# EAGLE design snappergps_board_2_1_0 (EAGLE 9.6.2)
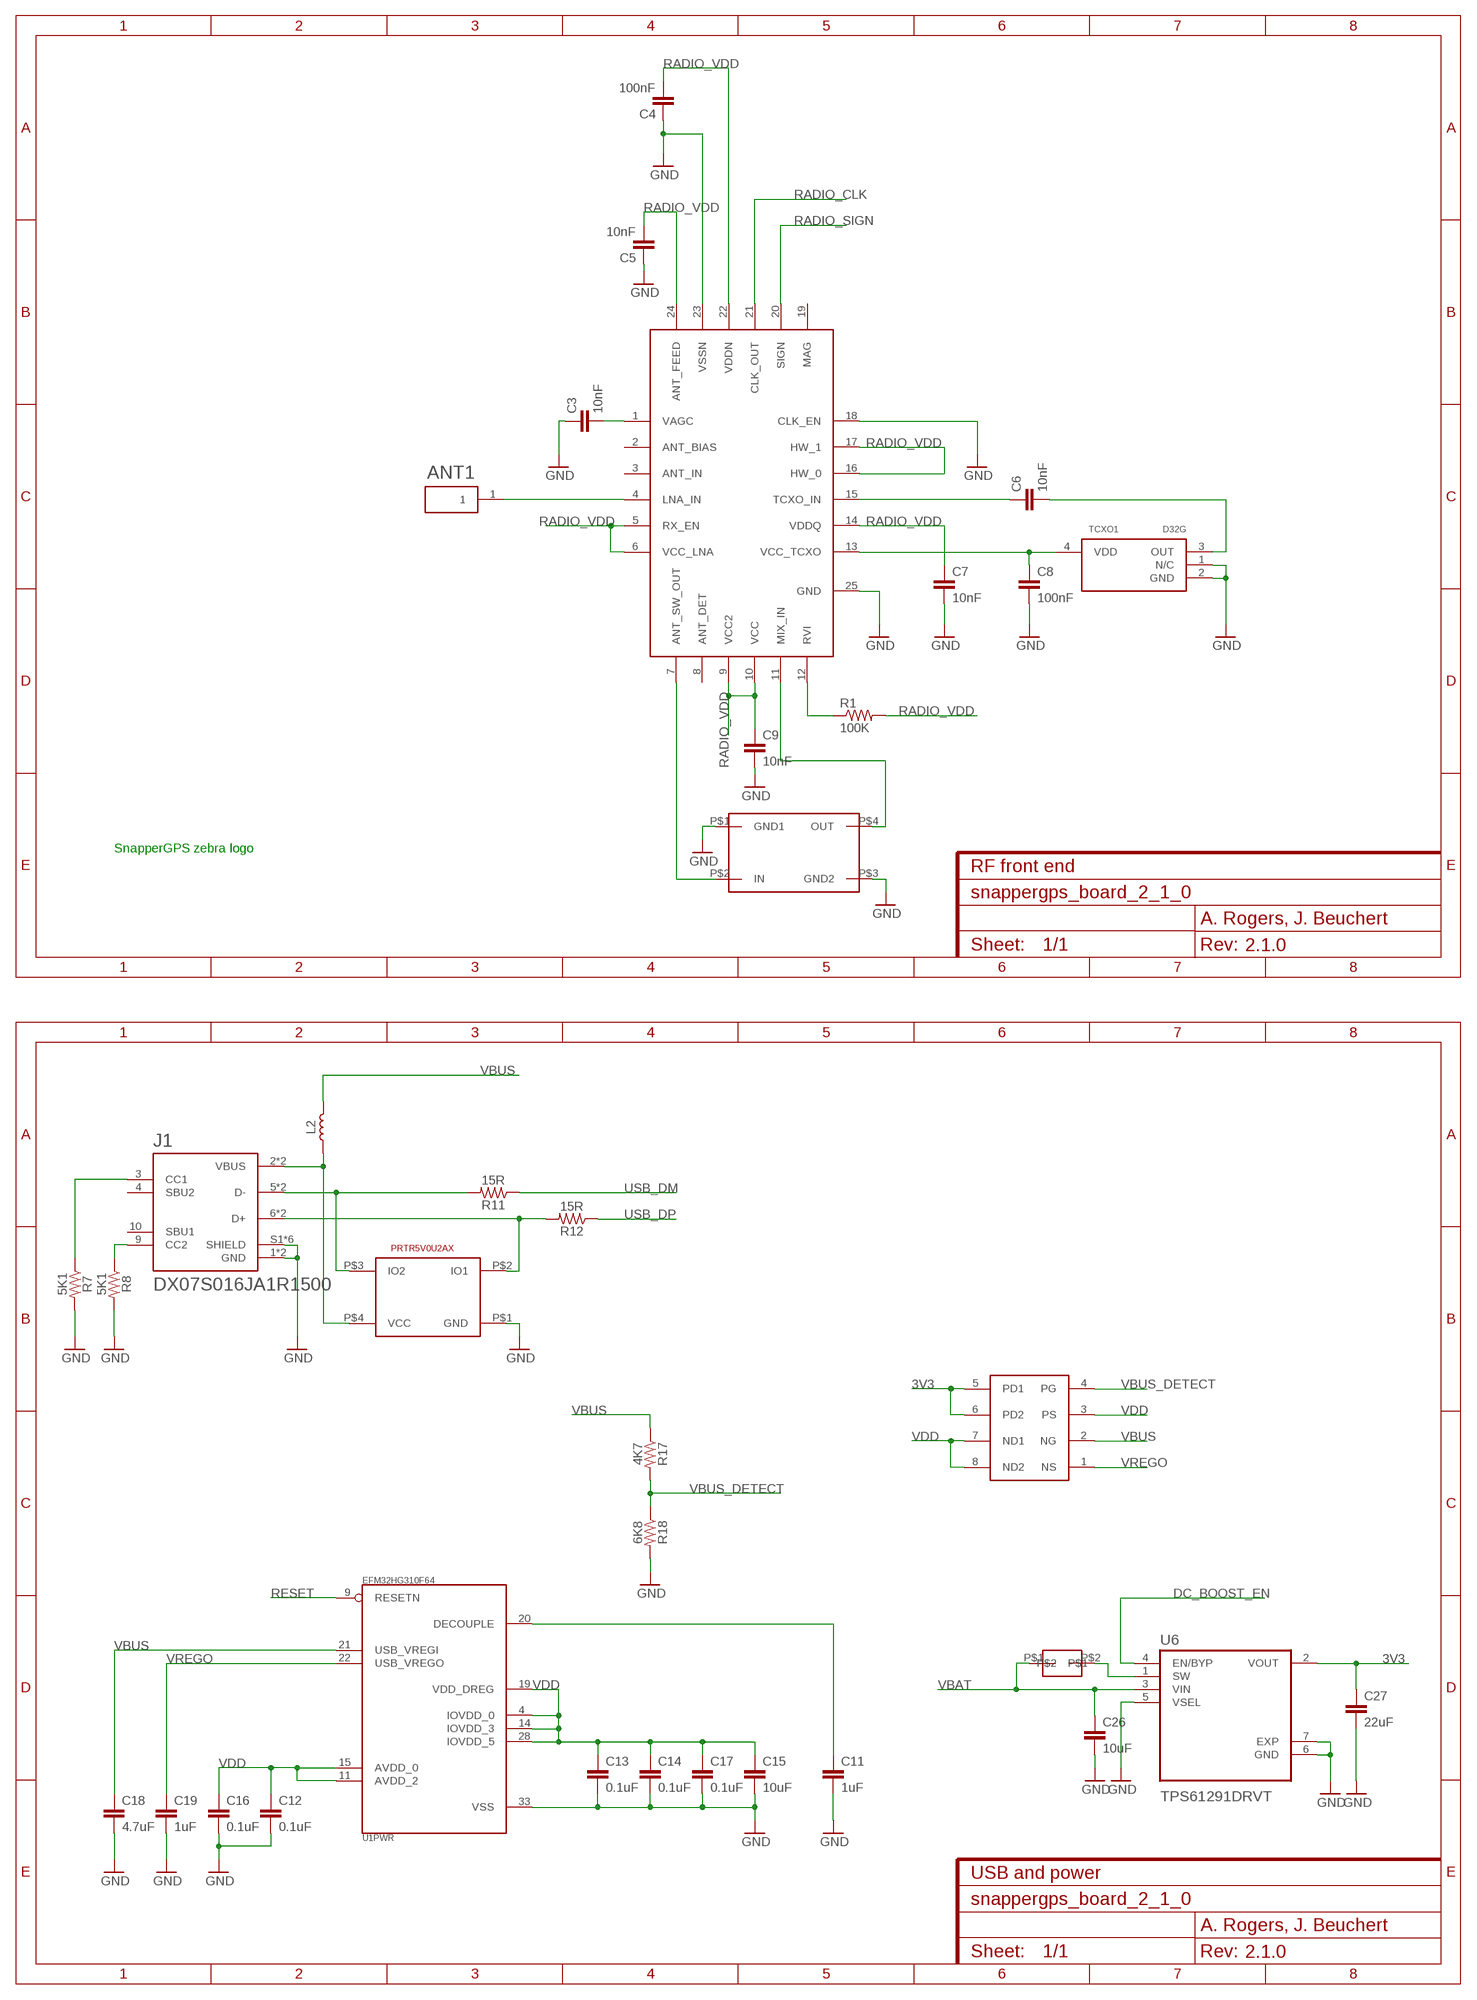
[diagram p0: schematic, sheet 1, part 1 of 2]
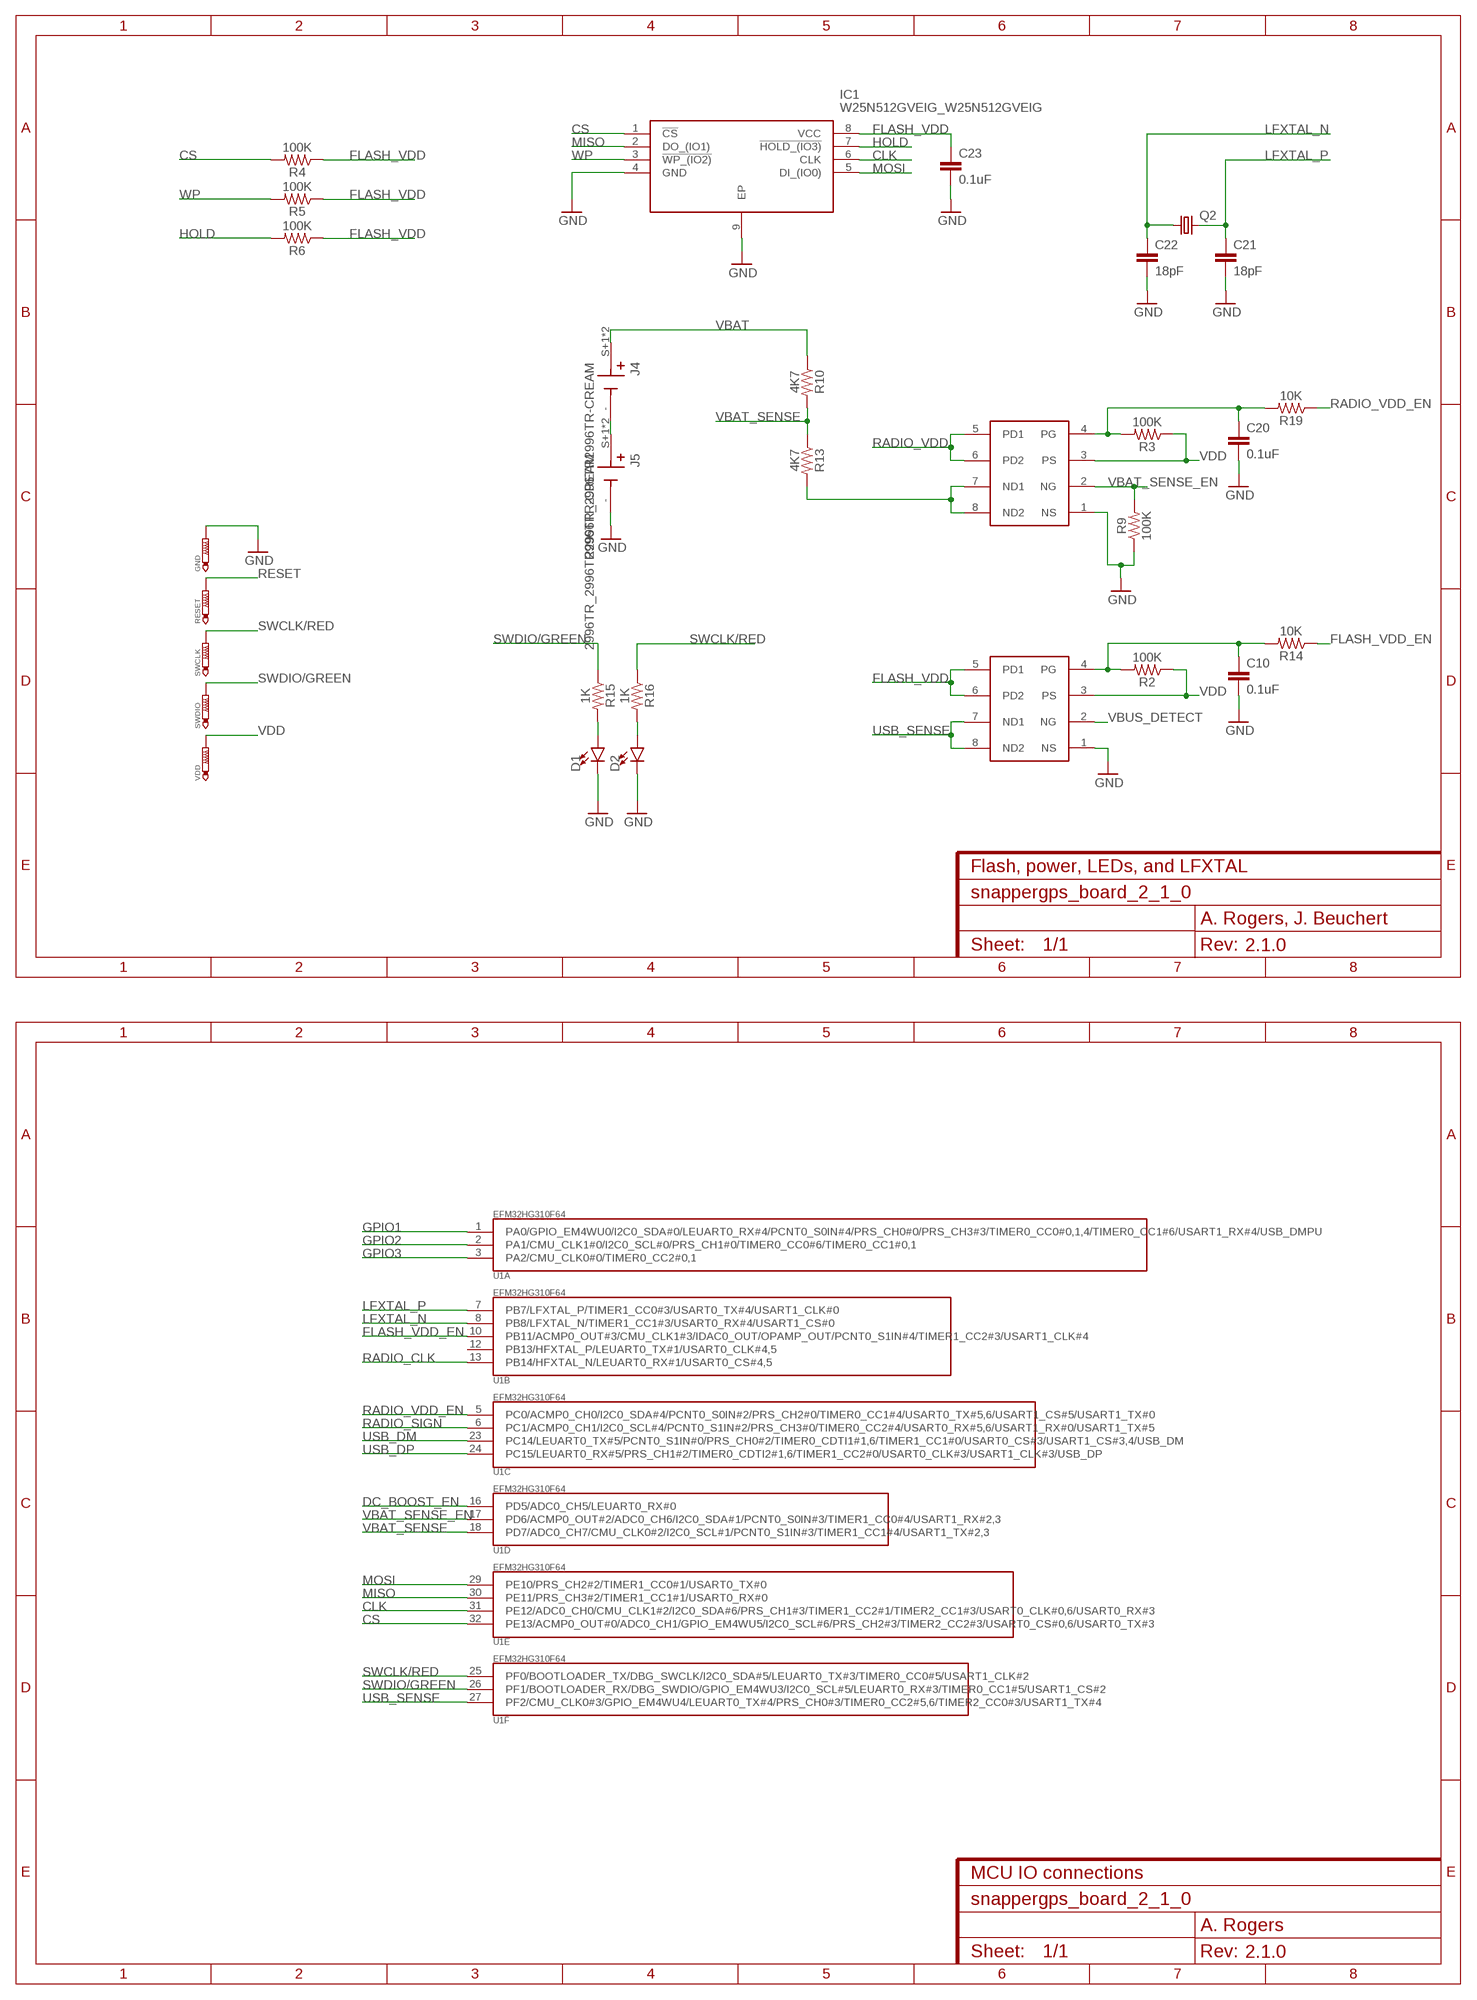
[diagram p1: schematic, sheet 1, part 2 of 2]
FRAME1 (FRAME-A4L): CNAME: RF front end; CREVISION: 2.1.0; DESIGNER: A. Rogers, J. Beuchert; REV: 2.4
FRAME2 (FRAME-A4L): CNAME: Flash, power, LEDs, and LFXTAL; CREVISION: 2.1.0; DESIGNER: A. Rogers, J. Beuchert
FRAME3 (FRAME-A4L): CNAME: USB and power; CREVISION: 2.1.0; DESIGNER: A. Rogers, J. Beuchert
FRAME4 (FRAME-A4L): CNAME: MCU IO connections; CREVISION: 2.1.0; DESIGNER: A. Rogers

## Parts
ANT1  GP.1575.25.2.A.02  [GP1575252A02]
C3  10nF  CAPACITOR_0402  [0402]
C4  100nF  CAPACITOR_0402  [0402]
C5  10nF  CAPACITOR_0402  [0402]
C6  10nF  CAPACITOR_0402  [0402]
C7  10nF  CAPACITOR_0402  [0402]
C8  100nF  CAPACITOR_0402  [0402]
C9  10nF  CAPACITOR_0402  [0402]
C10  0.1uF  CAPACITOR_0402  [0402]
C11  1uF  CAPACITOR_0603  [0603]
C12  0.1uF  CAPACITOR_0402  [0402]
C13  0.1uF  CAPACITOR_0402  [0402]
C14  0.1uF  CAPACITOR_0402  [0402]
C15  10uF  CAPACITOR_0603  [0603]
C16  0.1uF  CAPACITOR_0402  [0402]
C17  0.1uF  CAPACITOR_0402  [0402]
C18  4.7uF  CAPACITOR_0603  [0603]
C19  1uF  CAPACITOR_0603  [0603]
C20  0.1uF  CAPACITOR_0402  [0402]
C21  18pF  CAPACITOR_0402  [0402]
C22  18pF  CAPACITOR_0402  [0402]
C23  0.1uF  CAPACITOR_0402  [0402]
C26  10uF  C-EUC0603K  [C0603K]
C27  22uF  C-EUC0603K  [C0603K]
D1  LED0603  [LED-0603]
D2  LED0603  [LED-0603]
GND  PTR1B1,27  [B1,27]
IC1  W25N512GVEIG_W25N512GVEIG  [W25N512GVEIG_SON127P800X600X80-9N]
J1  DX07S016JA1R1500  [JAE_DX07S016JA1R1500]
J4  2996TR_2996TR2996TR-CREAM  [2996TR_BAT_2996TR]
J5  2996TR_2996TR2996TR-CREAM  [2996TR_BAT_2996TR]
L2  INDUCTOR  [0402]
Q1  TT8M1TRAMANDA  [AMANDA_TSST8]
Q2  CRYSTAL_JTX310  [3.2X1.5]
Q3  TT8M1TRAMANDA  [AMANDA_TSST8]
Q4  TT8M1TRAMANDA  [AMANDA_TSST8]
R1  100K  RESISTOR_0402  [0402]
R2  100K  RESISTOR_0402  [0402]
R3  100K  RESISTOR_0402  [0402]
R4  100K  RESISTOR_0402  [0402]
R5  100K  RESISTOR_0402  [0402]
R6  100K  RESISTOR_0402  [0402]
R7  5K1  RESISTOR_0402  [0402]
R8  5K1  RESISTOR_0402  [0402]
R9  100K  RESISTOR_0402  [0402]
R10  4K7  RESISTOR_0402  [0402]
R11  15R  RESISTOR_0402  [0402]
R12  15R  RESISTOR_0402  [0402]
R13  4K7  RESISTOR_0402  [0402]
R14  10K  RESISTOR_0402  [0402]
R15  1K  RESISTOR_0402  [0402]
R16  1K  RESISTOR_0402  [0402]
R17  4K7  RESISTOR_0402  [0402]
R18  6K8  RESISTOR_0402  [0402]
R19  10K  RESISTOR_0402  [0402]
RESET  PTR1B1,27  [B1,27]
SAW1  SAW_FILTER  [SAW_FILTER]
SWCLK  PTR1B1,27  [B1,27]
SWDIO  PTR1B1,27  [B1,27]
TCXO1  D32G  [D32G]
U1  EFM32HG310F64  [QFN32]
U2  RF_CIRCUIT-SE4150L  [QFN50P400X400X90-25N]
U3  TVS_DIODE-PRTR5V0U2AX  [TVS_DIODE-PRTR5V0U2AX]
U6  TPS61291DRVT  [SON65P200X200X80-7N]
U7  MDMK2020T3R3MM  [MDMK2020T3R3MM]
VDD  PTR1B1,27  [B1,27]

## Nets
3V3: C27.1 Q4.5(PD1) Q4.6(PD2) U6.2(VOUT)
CLK: IC1.6(CLK) U1.31(E:PE12/ADC0_CH0/CMU_CLK1#2/I2C0_SDA#6/PRS_CH1#3/TIMER1_CC2#1/TIMER2_CC1#3/USART0_CLK#0,6/USART0_RX#3)
CS: IC1.1(!CS) R4.2 U1.32(E:PE13/ACMP0_OUT#0/ADC0_CH1/GPIO_EM4WU5/I2C0_SCL#6/PRS_CH2#3/TIMER2_CC2#3/USART0_CS#0,6/USART0_TX#3)
DC_BOOST_EN: U1.16(D:PD5/ADC0_CH5/LEUART0_RX#0) U6.4(EN/BYP)
FLASH_VDD: C23.1 IC1.8(VCC) Q3.5(PD1) Q3.6(PD2) R4.1 R5.1 R6.1
FLASH_VDD_EN: R14.1 U1.10(B:PB11/ACMP0_OUT#3/CMU_CLK1#3/IDAC0_OUT/OPAMP_OUT/PCNT0_S1IN#4/TIMER1_CC2#3/USART1_CLK#4)
GND: C3.1 C4.1 C5.1 C7.2 C8.2 C9.2 C10.2 C11.2 C12.2 C13.2 C14.2 C15.2 C16.2 C17.2 C18.2 C19.2 C20.2 C21.2 C22.2 C23.2 C26.2 C27.2 D1.C D2.C GND.TP IC1.4(GND) IC1.9(EP) J1.1(GND) J1.12(GND) J1.S1(SHIELD) J1.S2(SHIELD) J1.S3(SHIELD) J1.S4(SHIELD) J1.S5(SHIELD) J1.S6(SHIELD) J5.- Q1.1(NS) Q3.1(NS) R7.2 R8.2 R9.1 R18.2 SAW1.P$1(GND1) SAW1.P$3(GND2) TCXO1.1(N/C) TCXO1.2(GND) U1.33(PWR:VSS) U2.18(CLK_EN) U2.23(VSSN) U2.25(GND) U3.P$1(GND) U6.5(VSEL) U6.6(GND) U6.7(EXP)
GPIO1: U1.1(A:PA0/GPIO_EM4WU0/I2C0_SDA#0/LEUART0_RX#4/PCNT0_S0IN#4/PRS_CH0#0/PRS_CH3#3/TIMER0_CC0#0,1,4/TIMER0_CC1#6/USART1_RX#4/USB_DMPU)
GPIO2: U1.2(A:PA1/CMU_CLK1#0/I2C0_SCL#0/PRS_CH1#0/TIMER0_CC0#6/TIMER0_CC1#0,1)
GPIO3: U1.3(A:PA2/CMU_CLK0#0/TIMER0_CC2#0,1)
HOLD: IC1.7(!HOLD_(IO3)) R6.2
LFXTAL_N: C22.1 Q2.1 U1.8(B:PB8/LFXTAL_N/TIMER1_CC1#3/USART0_RX#4/USART1_CS#0)
LFXTAL_P: C21.1 Q2.2 U1.7(B:PB7/LFXTAL_P/TIMER1_CC0#3/USART0_TX#4/USART1_CLK#0)
MISO: IC1.2(DO_(IO1)) U1.30(E:PE11/PRS_CH3#2/TIMER1_CC1#1/USART0_RX#0)
MIXIN [rf]: SAW1.P$4(OUT) U2.11(MIX_IN)
MOSI: IC1.5(DI_(IO0)) U1.29(E:PE10/PRS_CH2#2/TIMER1_CC0#1/USART0_TX#0)
N$1: Q1.7(ND1) Q1.8(ND2) R13.2
N$2: C20.1 Q1.4(PG) R3.2 R19.2
N$3: J1.9(CC2) R8.1
N$4: J1.3(CC1) R7.1
N$5 [rf]: ANT1.1 U2.4(LNA_IN)
N$6: R1.1 U2.12(RVI)
N$7: U6.1(SW) U7.P$2
N$8 [rf]: SAW1.P$2(IN) U2.7(ANT_SW_OUT)
N$9: C8.1 TCXO1.4(VDD) U2.13(VCC_TCXO)
N$10: C6.1 U2.15(TCXO_IN)
N$11: C6.2 TCXO1.3(OUT)
N$13: C11.1 U1.20(PWR:DECOUPLE)
N$14: C10.1 Q3.4(PG) R2.2 R14.2
N$15: J4.- J5.S+1(+) J5.S+2(+)
N$16: D1.A R15.2
N$17: D2.A R16.2
N$19: C3.2 U2.1(VAGC)
N$26: J1.2(VBUS) J1.11(VBUS) L2.1 U3.P$4(VCC)
N$35: J1.6(D+) J1.7(D+) R12.2 U3.P$2(IO1)
N$36: J1.5(D-) J1.8(D-) R11.2 U3.P$3(IO2)
RADIO_CLK: U1.13(B:PB14/HFXTAL_N/LEUART0_RX#1/USART0_CS#4,5) U2.21(CLK_OUT)
RADIO_SIGN: U1.6(C:PC1/ACMP0_CH1/I2C0_SCL#4/PCNT0_S1IN#2/PRS_CH3#0/TIMER0_CC2#4/USART0_RX#5,6/USART1_RX#0/USART1_TX#5) U2.20(SIGN)
RADIO_VDD: C4.2 C5.2 C7.1 C9.1 Q1.5(PD1) Q1.6(PD2) R1.2 U2.5(RX_EN) U2.6(VCC_LNA) U2.9(VCC2) U2.10(VCC) U2.14(VDDQ) U2.16(HW_0) U2.17(HW_1) U2.22(VDDN) U2.24(ANT_FEED)
RADIO_VDD_EN: R19.1 U1.5(C:PC0/ACMP0_CH0/I2C0_SDA#4/PCNT0_S0IN#2/PRS_CH2#0/TIMER0_CC1#4/USART0_TX#5,6/USART1_CS#5/USART1_TX#0)
RESET: RESET.TP U1.9(PWR:RESETN)
SWCLK/RED: R16.1 SWCLK.TP U1.25(F:PF0/BOOTLOADER_TX/DBG_SWCLK/I2C0_SDA#5/LEUART0_TX#3/TIMER0_CC0#5/USART1_CLK#2)
SWDIO/GREEN: R15.1 SWDIO.TP U1.26(F:PF1/BOOTLOADER_RX/DBG_SWDIO/GPIO_EM4WU3/I2C0_SCL#5/LEUART0_RX#3/TIMER0_CC1#5/USART1_CS#2)
USB_DM: R11.1 U1.23(C:PC14/LEUART0_TX#5/PCNT0_S1IN#0/PRS_CH0#2/TIMER0_CDTI1#1,6/TIMER1_CC1#0/USART0_CS#3/USART1_CS#3,4/USB_DM)
USB_DP: R12.1 U1.24(C:PC15/LEUART0_RX#5/PRS_CH1#2/TIMER0_CDTI2#1,6/TIMER1_CC2#0/USART0_CLK#3/USART1_CLK#3/USB_DP)
USB_SENSE: Q3.7(ND1) Q3.8(ND2) U1.27(F:PF2/CMU_CLK0#3/GPIO_EM4WU4/LEUART0_TX#4/PRS_CH0#3/TIMER0_CC2#5,6/TIMER2_CC0#3/USART1_TX#4)
VBAT: C26.1 J4.S+1(+) J4.S+2(+) R10.1 U6.3(VIN) U7.P$1
VBAT_SENSE: R10.2 R13.1 U1.18(D:PD7/ADC0_CH7/CMU_CLK0#2/I2C0_SCL#1/PCNT0_S1IN#3/TIMER1_CC1#4/USART1_TX#2,3)
VBAT_SENSE_EN: Q1.2(NG) R9.2 U1.17(D:PD6/ACMP0_OUT#2/ADC0_CH6/I2C0_SDA#1/PCNT0_S0IN#3/TIMER1_CC0#4/USART1_RX#2,3)
VBUS: C18.1 L2.2 Q4.2(NG) R17.1 U1.21(PWR:USB_VREGI)
VBUS_DETECT: Q3.2(NG) Q4.4(PG) R17.2 R18.1
VDD: C12.1 C13.1 C14.1 C15.1 C16.1 C17.1 Q1.3(PS) Q3.3(PS) Q4.3(PS) Q4.7(ND1) Q4.8(ND2) R2.1 R3.1 U1.4(PWR:IOVDD_0) U1.11(PWR:AVDD_2) U1.14(PWR:IOVDD_3) U1.15(PWR:AVDD_0) U1.19(PWR:VDD_DREG) U1.28(PWR:IOVDD_5) VDD.TP
VREGO: C19.1 Q4.1(NS) U1.22(PWR:USB_VREGO)
WP: IC1.3(!WP_(IO2)) R5.2
Unconnected: J1.4(SBU2) J1.10(SBU1) U1.12(B:PB13/HFXTAL_P/LEUART0_TX#1/USART0_CLK#4,5) U2.2(ANT_BIAS) U2.3(ANT_IN) U2.8(ANT_DET) U2.19(MAG)

## Notes on the sheet
- SnapperGPS zebra logo

## Library data of the parts
ANT1 = GP.1575.25.2.A.02:GP.1575.25.2.A.02: Antennas GPS THRU-HL PIN PASV PTCH ANT Source: Datasheet; ARROW_PART_NUMBER: GP.1575.25.2.A.02; ARROW_PRICE-STOCK: https://www.arrow.com/en/products/gp.1575.25.2.a.02/taoglas?region=nac; DESCRIPTION: Antennas GPS THRU-HL PIN PASV PTCH ANT; HEIGHT: 2.8mm; MANUFACTURER_NAME: Taoglas; MANUFACTURER_PART_NUMBER: GP.1575.25.2.A.02; MOUSER_PART_NUMBER: 960-GP1575252A02; MOUSER_PRICE-STOCK: https://www.mouser.co.uk/ProductDetail/Taoglas/GP1575252A02?qs=WUa1z%2FNV9%252B0rNVEYL1BhmQ%3D%3D
C3-C23 = bird_variant_2:CAPACITOR
C26 C27 = rcl:C-EU: CAPACITOR, European symbol
D1 D2 = bird_variant_2:LED: LED (Generic) Standard schematic elements and footprints for 5mm, 3mm, 1206, and 0603 sized LEDs. Generic LEDs with no color specified.
GND RESET SWCLK SWDIO VDD = testpad:PTR1: TEST PIN
IC1 = snappergps_board_2_9_four_layers:W25N512GVEIG_W25N512GVEIG: NAND Flash 512Mb Serial NAND flash, 3V Source: Datasheet; DESCRIPTION: NAND Flash 512Mb Serial NAND flash, 3V; HEIGHT: 0.8mm; MANUFACTURER_NAME: Winbond; MANUFACTURER_PART_NUMBER: W25N512GVEIG; MOUSER_PART_NUMBER: 454-W25N512GVEIG; MOUSER_PRICE-STOCK: https://www.mouser.co.uk/ProductDetail/Winbond/W25N512GVEIG/?qs=qSfuJ%252Bfl%2Fd5ygZJQb1vhdQ%3D%3D
J1 = DX07S016JA1R1500:DX07S016JA1R1500: USB-C (USB TYPE-C) USB 2.0 Receptacle Connector 24 (16+8 Dummy) Position Surface Mount, Right Angle; Through Hole Check prices; AVAILABILITY: In Stock; DESCRIPTION: USB-C (USB TYPE-C) USB 2.0 Receptacle Connector 24 (16+8 Dummy) Position Surface Mount, Right Angle; Through Hole; MF: JAE Electronics; MP: DX07S016JA1R1500; PACKAGE: None; PRICE: None
J4 J5 = snappergps_board_2_9_four_layers:2996TR_2996TR: Battery Retainer Coin, 11.6mm 1 Cell SMD (SMT) Tab Check availability; AVAILABILITY: In Stock; DESCRIPTION: SMT Holder for 11.6mm Cell-Tin Nickel Plated on T&R; MF: Keystone Electronics; MP: 2996TR; PACKAGE: None; PRICE: None; PURCHASE-URL: https://pricing.snapeda.com/search/part/2996TR/?ref=eda
L2 = bird_variant_2:INDUCTOR
Q1 Q3 Q4 = TT8M1TR-dual-np-mosfet:TT8M1TR
Q2 = bird_variant_2:CRYSTAL_JTX310: 3.2x1.5 SMD crystal
R1-R19 = bird_variant_2:RESISTOR: Generic Resistor Package
SAW1 = bird_variant_2:SAW_FILTER
TCXO1 = TCXO_test_brd_2_2:D32G
U1 = EFM32:EFM32HG310F64: EFM32HG310F64 Happy Microcontroller in 6mm x 6mm QFN32 package
U2 = bird_variant_2:RF_CIRCUIT-SE4150L
U3 = bird_variant_2:TVS_DIODE-PRTR5V0U2AX
U6 = TPS61291DRVT:TPS61291DRVT: Check prices; AVAILABILITY: Good; DESCRIPTION: Low Iq Boost Converter with 15nA Bypass Operation 6-WSON -40 to 85; MF: Texas Instruments; MP: TPS61291DRVT; PACKAGE: WSON-6 Texas Instruments; PRICE: None; PURCHASE-URL: https://pricing.snapeda.com/search/part/TPS61291DRVT/?ref=eda
U7 = alex:MDMK2020T3R3MM

## Net classes
0 default: width 0.152 mm, drill 0.305 mm, clearance 0.152 mm
2 rf: clearance 0.33 mm

## Board
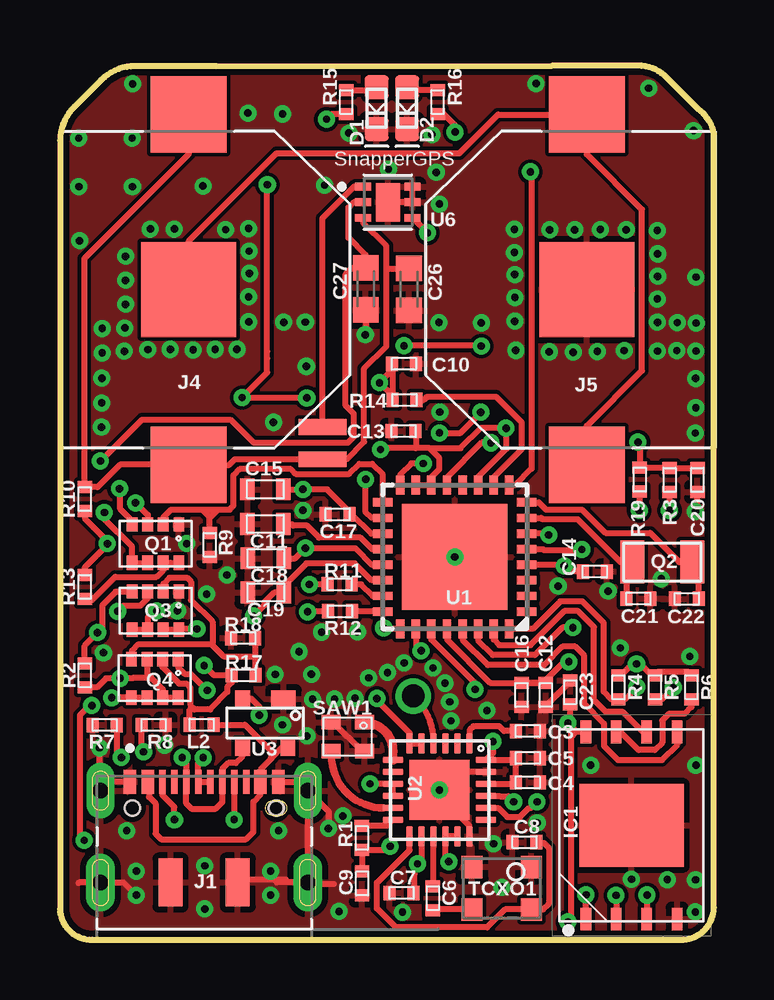
[diagram p2: board, top side]
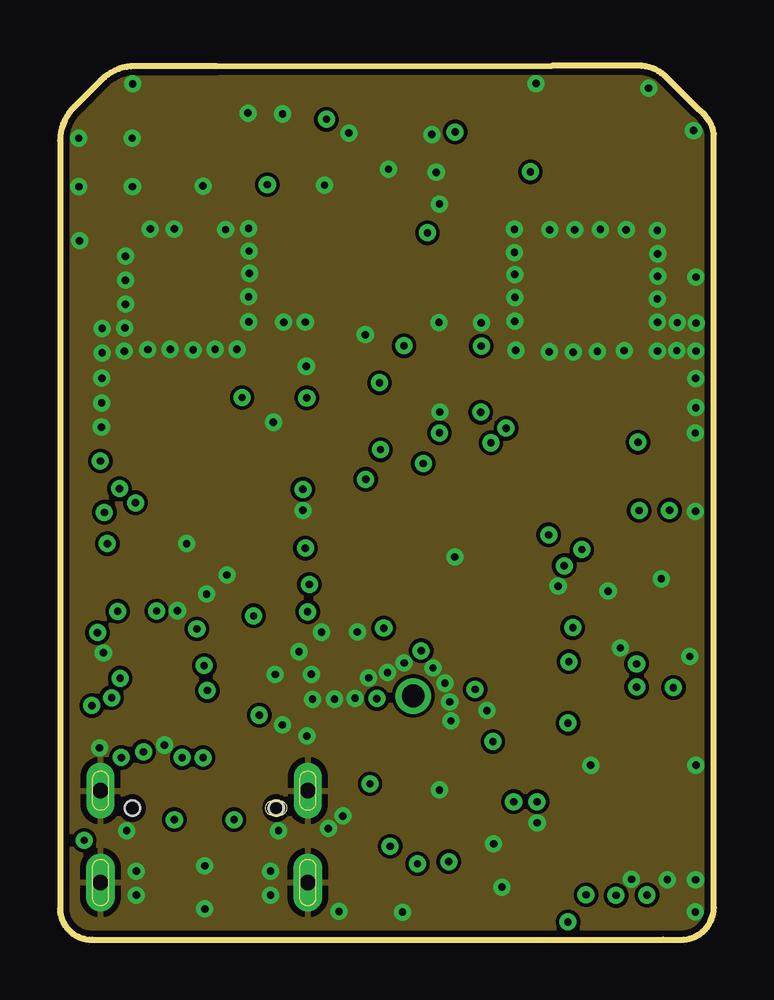
[diagram p3: board, inner layer Route2]
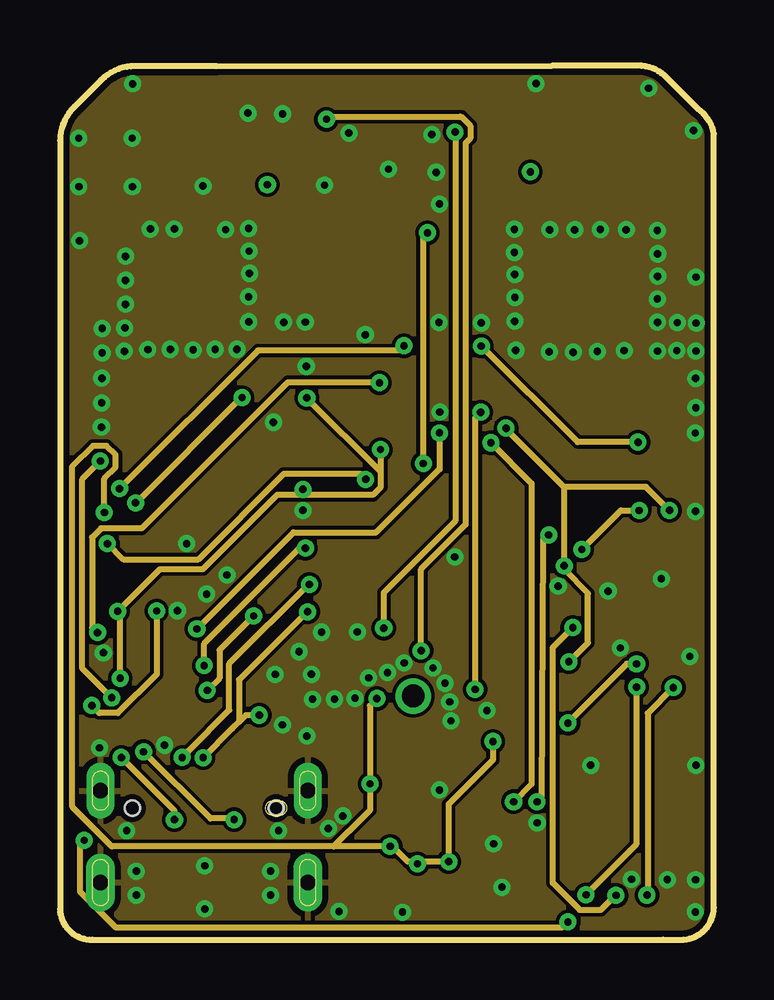
[diagram p4: board, inner layer Route15]
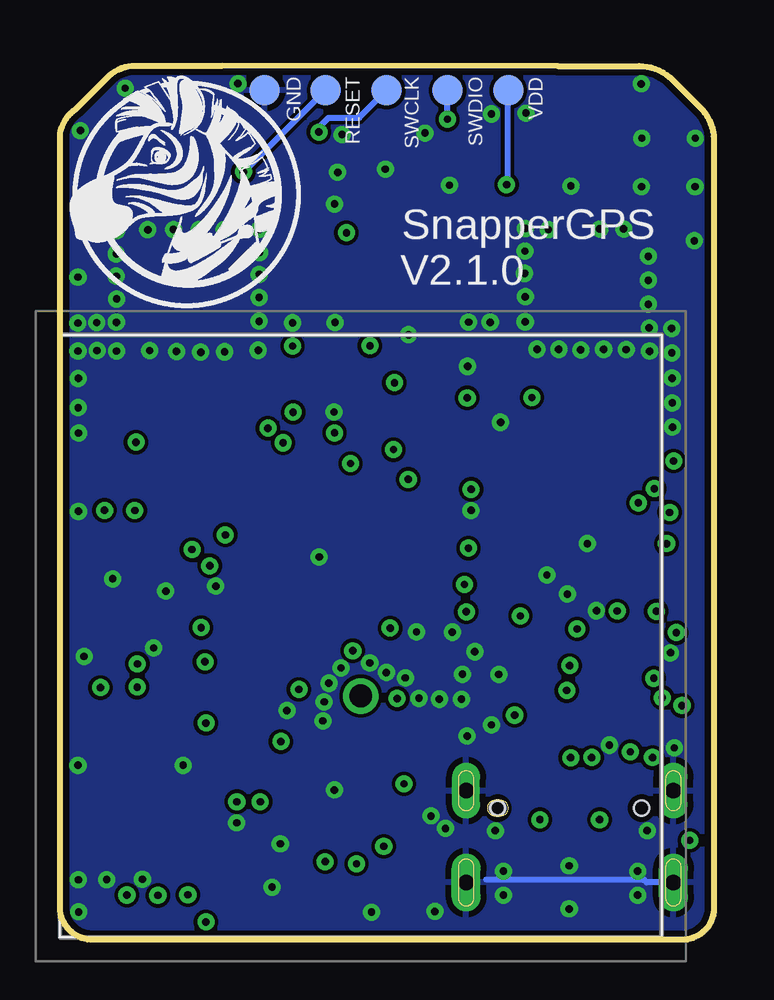
[diagram p5: board, bottom side, seen from below]

Size 27.27 x 36.43 mm. Coordinates in mm from the lower left corner, seen from the top.
Outline: 0,33.32 0,1.28 arc90 1.35,0 25.14,0 25.99,0 arc85 27.27,1.33 27.27,33.6 arc45 26.61,34.63 25.42,35.81 arc45 24.26,36.43 20.51,36.43 6.52,36.42 3.13,36.42 arc45 1.72,35.84 0.61,34.73 arc45 0,33.32
Copper layers (1+2*15+16): Top 0.035mm / dielectric 0.11mm / Route2 0.035mm / dielectric 0.4mm / Route15 0.035mm / dielectric 0.11mm / Bottom 0.035mm
Design rules "default *": minimum track width 10mil, minimum drill 18mil, track to track 6mil, track to pad 6mil, pad to pad 6mil, via to via 6mil, smd to smd 6mil, copper to edge 10mil, drill to drill 8mil, minimum pad ring 10mil, minimum via ring 8mil, stop-mask expansion 4mil, vias tented up to drill 20mil, thermal gap 10mil

### Footprints (pad centres in the part's own frame; a part is rotated, then mirrored left to right if it is on the bottom)
GP1575252A02 = drill 0.95 pad 1.478: 1 0,0
0402 = smd 0.5 x 0.6: 1 -0.5,0; 2 0.5,0
0603 = smd 0.6 x 0.9: 1 -0.75,0; 2 0.75,0
C0603K = smd 1.05 x 1.08: 1 -0.875,0; 2 0.875,0
LED-0603 = smd 1 x 1: A -0.877,0; C 0.877,0
B1,27 = smd 1.27 x 1.27: TP 0,0
W25N512GVEIG_SON127P800X600X80-9N = smd 0.95 x 0.45: 1 -3.9,1.905; 2 -3.9,0.635; 3 -3.9,-0.635; 4 -3.9,-1.905; 5 3.9,-1.905; 6 3.9,-0.635; 7 3.9,0.635; 8 3.9,1.905 | smd 3.45 x 4.35: 9 0,0
JAE_DX07S016JA1R1500 = smd 0.52 x 1: 1 -3.1,1.1; 2 -2.35,1.1; 11 2.35,1.1; 12 3.1,1.1 | smd 0.27 x 1: 3 -1.75,1.1; 4 -1.25,1.1; 5 -0.75,1.1; 6 -0.25,1.1; 7 0.25,1.1; 8 0.75,1.1; 9 1.25,1.1; 10 1.75,1.1 | smd 1 x 2: S1 -1.4,-3.1; S2 1.4,-3.1 | drill 0.65 long: S3 -4.32,0.725; S4 4.32,0.725 | drill 0.65 pad 1.2 long: S5 -4.32,-3.1; S6 4.32,-3.1 | hole 0.6: 3,0 | hole 0.63: 3,0; -3,0
2996TR_BAT_2996TR = smd 3.96 x 3.96: - 0,0 | smd 3.18 x 3.18: S+1 -7.3,0; S+2 7.3,0
AMANDA_TSST8 = smd 0.45 x 0.6: 1 -0.975,-0.8; 2 -0.325,-0.8; 3 0.325,-0.8; 4 0.975,-0.8; 5 0.975,0.8; 6 0.325,0.8; 7 -0.325,0.8; 8 -0.975,0.8
3.2X1.5 = smd 1 x 1.8: 1 -1.25,0; 2 1.25,0
SAW_FILTER = smd 0.8 x 0.6: P$1 -0.7,0.6; P$2 -0.7,-0.6; P$3 0.7,-0.6; P$4 0.7,0.6
D32G = smd 0.94 x 0.89: 1 0.885,-1.24; 2 0.885,1.24; 3 -0.885,1.24; 4 -0.885,-1.24
QFN32 = smd 0.8 x 0.35: 1 -3,2.275; 2 -3,1.625; 3 -3,0.975; 4 -3,0.325; 5 -3,-0.325; 6 -3,-0.975; 7 -3,-1.625; 8 -3,-2.275; 17 3,-2.275; 18 3,-1.625; 19 3,-0.975; 20 3,-0.325; 21 3,0.325; 22 3,0.975; 23 3,1.625; 24 3,2.275 | smd 0.35 x 0.8: 9 -2.275,-3; 10 -1.625,-3; 11 -0.975,-3; 12 -0.325,-3; 13 0.325,-3; 14 0.975,-3; 15 1.625,-3; 16 2.275,-3; 25 2.275,3; 26 1.625,3; 27 0.975,3; 28 0.325,3; 29 -0.325,3; 30 -0.975,3; 31 -1.625,3; 32 -2.275,3 | smd 4.4 x 4.4: 33 0,0
QFN50P400X400X90-25N = smd 0.86 x 0.27: 1 -1.935,1.25; 2 -1.935,0.75; 3 -1.935,0.25; 4 -1.935,-0.25; 5 -1.935,-0.75; 6 -1.935,-1.25; 13 1.935,-1.25; 14 1.935,-0.75; 15 1.935,-0.25; 16 1.935,0.25; 17 1.935,0.75; 18 1.935,1.25 | smd 0.27 x 0.86: 7 -1.25,-1.935; 8 -0.75,-1.935; 9 -0.25,-1.935; 10 0.25,-1.935; 11 0.75,-1.935; 12 1.25,-1.935; 19 1.25,1.935; 20 0.75,1.935; 21 0.25,1.935; 22 -0.25,1.935; 23 -0.75,1.935; 24 -1.25,1.935 | smd 2.5 x 2.5: 25 0,0
TVS_DIODE-PRTR5V0U2AX = smd 1.016 x 0.711: P$1 -0.762,-1.016 | smd 0.61 x 0.686: P$2 0.94,-1.016; P$3 0.94,1.016; P$4 -0.94,1.016
SON65P200X200X80-7N = smd 0.66 x 0.32: 1 -1.025,0.65; 2 -1.025,0; 3 -1.025,-0.65; 4 1.025,-0.65; 5 1.025,0; 6 1.025,0.65 | smd 1 x 1.6: 7 0,0
MDMK2020T3R3MM = smd 2 x 0.65: P$1 0,0.675; P$2 0,-0.675

### Placement (x,y rotation side)
ANT1  14.73,10.16 0 bottom
C3  19.51,8.7 180 top
C4  19.51,6.56 180 top
C5  19.51,7.57 180 top
C6  15.55,1.74 270 top
C7  14.24,1.95 180 top
C8  19.37,4.07 180 top
C9  12.59,2.35 270 top
C10  14.34,24.02 0 top
C11  8.57,17.33 180 top
C12  20.26,10.2 270 top
C13  14.33,21.2 180 top
C14  22.3,15.35 0 top
C15  8.57,18.78 180 top
C16  19.24,10.2 270 top
C17  11.58,17.73 180 top
C18  8.58,15.9 180 top
C19  8.58,14.48 180 top
C20  26.58,19.17 270 top
C21  24.12,14.22 0 top
C22  26.14,14.21 180 top
C23  21.27,10.31 90 top
C26  14.55,27.11 270 top
C27  12.75,27.13 270 top
D1  13.2,34.66 270 top
D2  14.47,34.66 270 top
GND  18.73,35.4 90 bottom
IC1  23.83,4.76 90 top
J1  6.01,5.49 0 top
J4  5.37,27.1 90 top
J5  21.97,27.1 270 top
L2  5.91,8.96 180 top
Q1  3.98,16.51 180 top
Q2  25.12,15.74 180 top
Q3  3.98,13.72 180 top
Q4  3.96,10.9 180 top
R1  12.59,4.25 270 top
R2  1.04,11.02 90 top
R3  25.42,19.17 90 top
R4  23.28,10.53 270 top
R5  24.81,10.53 270 top
R6  26.33,10.53 270 top
R7  1.87,8.95 180 top
R8  3.9,8.95 0 top
R9  6.24,16.46 90 top
R10  1.04,18.36 270 top
R11  11.66,14.81 180 top
R12  11.67,13.69 180 top
R13  1.04,14.71 270 top
R14  14.36,22.5 180 top
R15  11.93,34.92 90 top
R16  15.74,34.92 90 top
R17  7.67,11.02 0 top
R18  7.64,12.57 180 top
R19  24.17,19.18 90 top
RESET  16.19,35.4 90 bottom
SAW1  12,8.47 180 top
SWCLK  13.65,35.4 90 bottom
SWDIO  11.11,35.4 90 bottom
TCXO1  18.42,2.14 90 top
U1  16.46,15.96 180 top
U2  15.83,6.24 270 top
U3  8.55,9.03 180 top
U6  13.67,30.74 0 top
U7  10.94,20.7 180 top
VDD  8.57,35.4 90 bottom

### Tracks (layer width: path | path; a pad name or v marks a point on that pad's centre or on a via)
3V3  (via drill 0.3)
  Top 0.254: Q4.6 Q4.5 2.17,10.1 v2.15,10.09 | U6.2 12.25,30.74 12.03,30.52 12.03,29.27 12.75,28.54 C27.1 12.16,28 11.91,27.75 11.91,22.27 12.26,21.91 12.26,20.97 12.01,20.72 8.08,20.72 7.11,21.68 3.42,21.68 1.7,19.95 v1.68,19.95
  Route15 0.254: v1.68,19.95 0.93,19.2 0.93,11.31 v2.15,10.09
CLK
  Top 0.254: IC1.6 24.31,8.66 23.48,9.5 22.77,9.5 22.26,10 22.26,13.04 21.6,13.7 21.03,13.7 19.62,12.29 19.62,12.28 18.32,12.28 18.09,12.51 U1.31
CS  (via drill 0.3)
  Top 0.254: IC1.1 21.92,1.86 v21.94,1.87 | v24.05,10.53 23.54,10.03 R4.2 22.98,10.03 22.67,10.34 22.67,13.22 21.78,14.1 20.86,14.1 19.71,12.96 U1.32
  Route15 0.254: v21.94,1.87 24.03,3.97 24.03,10.51 v24.05,10.53
DC_BOOST_EN  (via drill 0.3)
  Top 0.254: v15.15,19.85 14.65,19.85 14.19,19.39 U1.16 | U6.4 v15.32,29.47
  Route15 0.254: v15.32,29.47 15.14,29.29 15.14,19.86 v15.15,19.85
FLASH_VDD  (via drill 0.3)
  Top 0.254: R6.1 26.19,11.17 24.95,11.17 R5.1 24.68,11.03 24.2,11.5 v24.04,11.5 23.86,11.5 23.39,11.03 R4.1 | v4.03,13.7 3.92,13.7 3.66,13.44 Q3.6 Q3.5 | IC1.8 21.55,8.66 | 21.55,8.66 21.29,8.92 | C23.1 21.28,9.8 21.28,9.13 | 21.28,8.93 v21.18,9.03 21.28,9.13 | 21.29,8.92 21.29,8.42 | 21.29,8.42 21.29,0.85 v21.18,0.74 | v1.33,9.76 1.23,9.76 0.83,9.36 0.83,4.32 v1.01,4.14 | 21.55,8.66 21.54,8.66 21.29,8.42 | 21.28,9.13 21.28,8.93 | 21.28,8.93 21.29,8.92
  Route15 0.254: v21.18,9.03 21.18,9.05 23.63,11.5 v24.04,11.5 | v4.03,13.7 4.03,11.07 2.42,9.45 1.64,9.45 v1.33,9.76 | v1.01,4.14 0.83,3.97 0.83,2.01 2.33,0.51 20.95,0.51 v21.18,0.74
FLASH_VDD_EN
  Top 0.254: U1.10 18.09,19.29 19.25,20.45 19.25,21.57 18.19,22.64 15.31,22.64 15.17,22.5 R14.1
GND  (via drill 0.3)
  Top 0.254: SAW1.P$1 12.59,7.87 11.39,9.07 SAW1.P$3 | U2.23 15.19,6.99 U2.25 15.83,6 17.07,4.75 U2.18 | J1.S4 10.33,6.59 J1.12 | J1.1 2.18,6.59 1.69,6.1 J1.S3 1.65,6.21 v1.65,8 | J1.S5 1.62,2.31 | J1.S2 7.54,2.52 8.92,2.52 | 8.92,2.52 9.42,2.52 | J1.S6 10.41,2.31 11.42,2.31 | U6.6 U6.5 U6.7 | J1.S5 0.8,2.39 0.77,2.35 | C23.2 21.27,10.76 20.26,9.75 C12.2 | C27.2 12.76,26.24 12.76,25.22 v12.73,25.22 | J1.S6 J1.S4 | J1.S4 11.19,5.35 v11.19,4.63 | J1.S5 2.65,2.39 v3.18,1.86 | J1.S6 9.05,2.39 8.92,2.52 | v26.5,17.86 26.58,17.94 C20.2
  Bottom 0.254: J1.S5 2.8,2.39 2.92,2.5 9.5,2.5
  other vias: 16.46,15.96 10.91,12.82 15.51,33.57 12.05,33.63 9.33,25.74 6.04,1.28 26.49,1.15 5.96,31.42 15.83,6.24 15.69,31.99 22.13,7.27 7.84,34.46 18.43,2.19 4.36,8.11 1.76,24.46 9.12,4.54 25.07,15.04 0.78,33.41 5.28,16.51 6.11,14.41 18.97,26.77 12.3,10.06 8.97,11.06 4.9,13.72 11.03,31.45 1.76,25.49 10.27,23.9 8.9,21.57 23.83,2.52 11.64,1.18 19.85,35.69 15.82,30.67 18.96,27.73 14.28,1.15 16.05,10.7 15.8,25.73 10.23,25.74 10.48,11.07 0.82,29.14 1.81,11.96 11.8,5.16 9.28,8.96 16.25,9.91 12.4,12.83 18.08,4 19.9,4.87 14.35,11.54 18.95,29.62 7.87,26.8 2.7,25.51 1.73,21.36 26.51,22.18 25.74,25.73 26.52,25.71 26.52,24.54 26.5,23.4 24.91,25.74 3.18,2.86 2.73,26.49 2.73,27.49 2.73,28.49 3.77,29.63 4.77,29.63 7.9,27.78 6.9,29.6 7.86,29.65 13.7,32.12 24.9,26.71 24.92,28.59 24.92,27.66 24.91,29.57 23.61,29.59 22.53,29.61 21.46,29.59 26.52,27.63 18.94,28.65 1.74,22.38 1.75,23.41 20.42,29.6 26.42,33.73 24.55,35.5 8.78,2.86 8.78,1.86 6.04,3.08 26.5,2.5 26.52,7.28 25.32,2.5 9.97,12.01 15.55,11.33 12.87,10.91 13.66,11.14 16.3,9.12 11.45,10.03 10.53,10.02 10.29,8.49 17.8,9.55 2.69,24.53 3.66,24.6 4.6,24.61 5.55,24.59 6.47,24.61 7.38,24.61 7.87,25.76 26.49,21.12 26.26,11.81 23.36,12.16 25.72,24.56 23.53,24.56 22.41,24.52 20.4,24.51 3.02,31.4 0.79,31.4 3.01,33.41 3.03,35.68 2.78,4.54 9.28,34.42 10.13,17.9 15.84,21.99 22.85,14.53 18.96,25.78 21.4,24.49 20.77,14.74 17.57,25.72 19,24.57 24.91,24.54 6.96,15.21 7.88,28.71
  pour Route2: -1.43,38.8 32.5,38.8 32.5,-1.08 -1.43,-1.08
  pour Top: -0.64,38.32 32.07,38.32 32.07,-0.76 -0.64,-0.76
  pour Bottom: -2.1,39.59 33.15,39.59 33.15,-1.6 -2.1,-1.6
  pour Route15: -1.82,39.25 32.91,39.25 32.91,-1.31 -1.82,-1.31
HOLD
  Top 0.254: IC1.7 23.37,8.66 24.12,7.91 24.8,7.91 25.11,8.21 25.11,9.13 25.39,9.42 26.04,9.42 26.33,9.71 R6.2
LFXTAL_N
  Top 0.254: U1.8 19.96,18.23 20.26,17.93 21.77,17.93 22.74,16.96 24.6,16.96 25.82,15.74 Q2.1 26.64,15.74 C22.1
LFXTAL_P
  Top 0.254: C21.1 23.62,15.5 Q2.2 23.37,15.74 21.59,17.52 20.12,17.52 20.06,17.58 U1.7
MISO  (via drill 0.3)
  Top 0.254: v23.19,1.85 v23.19,1.84 IC1.2 | U1.30 17.44,12.48 18.05,11.87 19.8,11.87 20.94,13.01 v21.38,13.01
  Route15 0.254: v23.19,1.85 23.15,1.85 22.55,1.24 21.67,1.24 20.55,2.37 20.55,8.82 20.54,8.83 20.54,12.17 v21.38,13.01
MIXIN
  Top 0.254: U2.11 13.5,5.49
  Top 0.305: 13.5,5.49 arc-90 11.32,7.67 11.32,7.85 SAW1.P$4
MOSI
  Top 0.254: IC1.5 25.73,8.13 25.1,7.5 23.26,7.5 22.69,8.07 22.69,9 21.86,9.83 21.86,11.85 21.48,12.22 20.96,12.22 20.19,11.45 17.84,11.45 16.79,12.51 U1.29
N$1
  Top 0.254: Q1.7 4.6,15.71 | 4.6,15.71 Q1.8 | 4.6,15.71 4.02,15.13 2.3,15.13 1.32,14.15 1.06,14.15 R13.2
N$2  (via drill 0.3)
  Top 0.254: Q1.4 3.01,17.46 2.52,17.95 2.52,18.77 v2.49,18.8 | C20.1 R3.2 R19.2 24.17,20.67 v24.1,20.74 | v17.57,24.75 v17.57,24.76 17.57,24.76 v14.34,24.76
  Route15 0.254: v2.49,18.8 v2.5,18.8 8.25,24.56 14.14,24.56 v14.34,24.76 | v24.1,20.74 21.59,20.74 17.58,24.75 v17.57,24.75
N$3  (via drill 0.3)
  Top 0.254: J1.9 v7.26,5 | R8.1 3.39,7.93 v3.48,7.83
  Route15 0.254: v3.48,7.83 v3.49,7.83 6.27,5.05 7.21,5.05 v7.26,5
N$4  (via drill 0.3)
  Top 0.254: J1.3 4.26,6.04 4.77,5.53 v4.77,5 | v2.56,7.59 2.37,7.79 R7.1
  Route15 0.254: v4.77,5 4.77,5.38 v2.56,7.59
N$5
  Top 0.254: U2.4 15.58,8.32 arc45 14.88,9.99 14.88,10 ANT1.1
N$6
  Top 0.254: U2.12 13.65,4.75 R1.1
N$7
  Top 0.254: U6.1 12.27,31.39 10.94,30.07 U7.P$2
N$8
  Top 0.381: SAW1.P$2 12.7,9.04 arc-90 13.89,7.85 U2.7
N$9
  Top 0.254: C8.1 19.9,4.03 20.18,4.03 20.38,3.83 20.38,1.5 20.14,1.26 TCXO1.4 18.56,1.26 17.81,0.51 14.01,0.51 13.21,1.31 13.21,2.37 14.58,3.73 U2.13
N$10
  Top 0.254: U2.15 15.58,3.88 15.56,3.86 15.56,2.25 C6.1
N$11
  Top 0.254: TCXO1.3 15.57,1.26 C6.2
N$13
  Top 0.254: U1.20 13.01,16.28 12.53,16.77 10.8,16.77 10.3,17.26 9.73,17.26 9.66,17.33 C11.1
N$14  (via drill 0.3)
  Top 0.254: R2.2 1.04,12.27 v1.57,12.8 | Q3.4 2.99,14.5 2.32,14.5 1.77,13.95 1.77,13 v1.57,12.8 | v1.57,12.8 | C10.1 13.86,24 R14.2 13.86,22.69 v13.32,23.22 13.84,23.74 C10.1
  Route15 0.254: v1.57,12.8 1.55,12.8 1.34,13.02 1.34,16.77 1.71,17.15 3.41,17.15 9.51,23.24 13.3,23.24 v13.32,23.22
N$15
  Top 0.254: J5.S+2 21.97,21.42 24.27,23.72 24.27,30.44 21.97,32.74 J5.S+1 18.27,34.4 16.65,32.78 9.03,32.78 5.37,29.12 J4.-
N$16
  Top 0.254: R15.2 13.08,35.42 D1.A
N$17
  Top 0.254: D2.A 14.6,35.42 R16.2
N$19
  Top 0.254: C3.2 18.51,8.7 18.32,8.89 17.23,8.89 17.08,8.74 U2.1
N$26
  Top 0.254: J1.2 3.72,6.54 3.72,5.95 3.98,5.69 3.98,4.42 4.21,4.19 7.77,4.19 8.06,4.49 8.06,5.75 8.36,6.05 J1.11 8.37,7.1 8.83,7.57 8.82,7.58 | 8.82,7.58 9.25,8.02 U3.P$4 | 8.82,7.58 8.8,7.6 8.8,7.88 7.71,8.96 L2.1
N$35  (via drill 0.3)
  Top 0.254: J1.7 J1.6 5.76,7.38 v5.97,7.59 | v10.33,13.67 10.35,13.7 R12.2 | v8.31,9.36 8.31,9.72 7.98,10.05 U3.P$2
  Route15 0.254: v5.97,7.59 7.18,8.8 | 7.18,8.8 7.74,9.36 v8.31,9.36 | 7.18,8.8 7.46,9.08 7.46,10.84 10.3,13.67 v10.33,13.67
N$36  (via drill 0.3)
  Top 0.254: R11.2 v10.4,14.81 | v5.1,7.6 5.26,7.43 J1.5 5.26,5.68 5.48,5.46 6.5,5.46 6.76,5.73 J1.8 6.76,7.11 7.01,7.37 7.33,7.37 7.61,7.65 U3.P$3
  Route15 0.254: v5.1,7.6 5.34,7.84 5.34,7.85 7.06,9.57 7.06,11.51 10.36,14.81 v10.4,14.81
RADIO_CLK  (via drill 0.3)
  Top 0.254: U1.13 16.14,19.27 17.58,20.72 v17.97,20.72 | v18.92,5.75 18.69,5.98 18.34,5.98 18.33,5.99 U2.21
  Route15 0.254: v18.92,5.75 19.66,6.5 19.66,19.02 v17.97,20.72 | v17.97,20.72
RADIO_SIGN  (via drill 0.3)
  Top 0.254: v20.38,16.88 20.38,16.93 U1.6 | v19.89,5.75 19.63,5.49 19.56,5.49 19.18,5.12 18.66,5.12 18.28,5.49 U2.20
  Route15 0.254: v19.89,5.75 20.04,5.75 20.09,5.8 20.15,16.69 20.33,16.88 v20.38,16.88
RADIO_VDD  (via drill 0.3)
  Top 0.254: v18.05,8.26 18.05,7.78 U2.24 18.97,7.49 18.99,7.51 | U2.22 19.01,6.49 C4.2 18.99,6.58 18.99,7.51 | U2.17 U2.16 | U2.16 | v13.77,3.89 13.62,3.74 12.59,3.74 R1.2 C9.1 | C7.1 14.77,1.97 14.77,2.71 14.78,2.71 14.78,3.04 v14.91,3.17 | C5.2 18.99,7.55 18.99,7.51 | U2.14 15.08,3.34 v14.91,3.17 | v14.91,3.17 | Q1.6 Q1.5 3.01,16.39 1.85,17.55 v1.85,17.81 | U2.5 U2.6 14.58,8.62 13.22,9.97 13.25,9.97 13.25,10.02 v13.21,10.05 | U2.10 U2.9 v12.93,6.49 v12.93,6.5 | v16.21,3.26 16.08,3.39 U2.16
  Route15 0.254: 15,3.26 v16.21,3.26 v16.2,3.27 16.2,5.65 18.05,7.5 v18.05,8.26 | 15,3.26 14.51,3.26 13.87,3.89 v13.77,3.89 11.41,3.89 | 15,3.26 v14.91,3.17 | v13.21,10.05 13.21,10.03 12.93,9.75 v12.93,6.5 12.93,5.39 12.06,4.52 12.04,4.52 11.41,3.89 | 11.41,3.89 2.16,3.89 0.52,5.53 0.52,19.74 1.37,20.59 1.95,20.59 2.32,20.22 2.32,19.69 1.85,19.22 v1.85,17.81
RADIO_VDD_EN  (via drill 0.3)
  Top 0.254: U1.5 20.15,16.28 20.19,16.24 21.76,16.24 v21.76,16.27 | v24.15,17.89 24.17,17.91 R19.1
  Route15 0.254: v24.15,17.89 23.39,17.89 v21.76,16.27
RESET  (via drill 0.3)
  Top 0.254: U1.9 18.98,18.96 19.66,19.63 19.66,31.97 v19.62,32.01
  Bottom 0.254: RESET.TP 19.58,32.01 v19.62,32.01
SWCLK/RED  (via drill 0.3)
  Top 0.254: U1.25 13.54,12.96 v13.5,12.99 | v16.47,33.67 16.47,33.94 16.48,33.95 16.01,34.42 R16.1
  Route15 0.254: v13.5,12.99 13.5,14.47 16.49,17.46 16.49,33.66 v16.47,33.67
  Bottom 0.254: SWCLK.TP 14.8,34.26 16.08,34.26 16.47,33.87 v16.47,33.67
SWDIO/GREEN  (via drill 0.3)
  Top 0.254: U1.26 14.85,12.95 14.85,12.26 v15.06,12.04 | R15.1 11.33,34.42 v11.11,34.2
  Route15 0.254: v15.06,12.04 15.06,15.45 16.91,17.3 16.91,33.21 17.11,33.41 17.11,33.93 16.74,34.31 16.69,34.31 16.68,34.32 11.23,34.32 v11.11,34.2
  Bottom 0.254: v11.11,34.2 SWDIO.TP
USB_DM
  Top 0.254: U1.23 13.05,14.32 12.56,14.81 R11.1
USB_DP
  Top 0.254: R12.1 12.18,13.68 U1.24
USB_SENSE  (via drill 0.3)
  Top 0.254: v5.71,12.96 5,12.96 Q3.8 Q3.7 | U1.27 15.49,12.52 17.31,10.7 v17.31,10.43 | v15.82,21.13 15.84,21.11 16.67,21.11 17.32,21.76 17.32,21.77 v17.55,21.99
  Route15 0.254: v5.71,12.96 9.73,16.98 13.19,16.98 15.83,19.62 v15.83,21.12 v15.82,21.13 | v17.31,10.43 17.32,10.44 17.32,21.76 v17.55,21.99
VBAT
  Top 0.254: J4.S+2 5.37,32.75 1.02,28.4 1.02,18.88 R10.1 1.57,18.86 2.5,19.8 J4.S+1 5.41,19.8 5.42,19.79 7.06,19.79 7.29,20.02 U7.P$1 11.94,20.02 12.68,20.76 12.68,23.82 13.6,24.74 13.6,27.98 | 13.6,27.98 C26.1 | U6.3 12.64,29.89 13.6,28.93 13.6,27.98
VBAT_SENSE  (via drill 0.3)
  Top 0.254: v12.75,19.19 12.73,19.17 12.73,17.86 13.01,17.58 U1.18 | R10.2 1.04,17.56 1.98,16.62 v1.98,16.51 1.98,16.46 1.04,15.52 R13.1
  Route15 0.254: v1.98,16.51 v1.99,16.51 2.64,15.86 5.78,15.86 9.33,19.41 12.53,19.41 v12.75,19.19
VBAT_SENSE_EN
  Top 0.254: Q1.2 4.31,17.61 4.62,17.92 5.96,17.92 5.96,17.91 | R9.2 6.24,17.58 6.27,17.6 | 6.27,17.6 5.96,17.91 | 6.27,17.6 6.58,17.91 | 6.58,17.91 5.96,17.91 | 6.58,17.91 6.6,17.93 7.07,17.93 7.24,18.09 7.24,19.36 7.5,19.61 9.63,19.61 9.83,19.42 12.06,19.42 12.48,19.84 13.01,19.84 13.46,19.39 U1.17
VBUS  (via drill 0.3)
  Top 0.254: C18.1 9.81,15.9 v10.24,16.32 12.31,16.32 13.01,15.63 U1.21 | Q4.2 4.28,11.36 4.96,10.68 5.27,10.68 5.44,10.51 5.44,9.79 5.61,9.62 5.61,9.6 | L2.2 5.41,9.6 5.61,9.6 | v6.01,11.43 6.42,11.02 R17.1 7.17,10.72 6.98,10.54 6.98,10.33 6.27,9.62 6.27,9.6 5.61,9.6
  Route15 0.254: v10.24,16.32 9.99,16.32 6.01,12.34 v6.01,11.43
VBUS_DETECT
  Top 0.254: Q4.4 3,11.74 3,12.05 3.26,12.3 6.32,12.3 6.36,12.27 | 6.36,12.27 6.81,11.81 8.14,11.81 | Q3.2 4.31,14.73 4.31,14.84 4.57,15.1 5.3,15.1 5.46,14.93 5.46,14.15 6.36,13.26 6.36,12.27 | R18.1 8.14,11.81 | 8.14,11.81 8.14,11.05 R17.2
VDD  (via drill 0.3)
  Top 0.254: C16.1 C12.1 20.26,10.84 | 12.18,17.73 12.98,16.93 U1.19 | 12.18,17.73 11.14,18.77 v10.13,18.77 v10.12,18.78 C15.1 | U1.15 U1.14 15.49,19.28 15.82,19.62 15.82,20.08 15.42,20.49 | U1.4 20.98,15.63 v21.02,15.59 21.27,15.35 C14.1 | Q4.8 Q4.7 4.28,10.44 3.8,10.92 3.6,10.92 | Q3.3 3.66,14.23 3.35,13.92 2.64,13.92 v2.41,13.69 | 3.6,10.92 3.07,10.92 3.06,10.91 2.53,10.91 v2.51,10.9 1.92,10.9 1.54,10.52 1.52,10.52 R2.1 | Q4.3 3.63,10.95 3.6,10.92 | v3.15,18.21 3.66,17.71 Q1.3 | v21.22,11.59 21.01,11.59 20.26,10.84 | 20.26,10.84 20.11,10.69 20.11,10.83 19.99,10.71 17.94,10.71 16.14,12.51 U1.28 | v10.29,22.59 7.61,22.59 v7.59,22.6 v7.6,22.6 8.65,23.65 8.65,24.23 8.65,24.53 v8.65,31.48 | C17.1 12.18,17.73 | v25.41,17.9 25.42,17.91 R3.1 | 15.42,20.49 14.84,20.49 | 14.84,20.49 13.42,20.49 v13.36,20.43 13.44,20.51 | 18.62,21.13 18.39,21.35 18.25,21.35 | 18.25,21.35 17.57,21.35 16.71,20.49 15.42,20.49 | 18.62,21.13 18.62,20.47 17.44,19.29 U1.11 | C13.1 14.84,20.49 | 18.25,21.35 18.28,21.33 v18.6,21.33 18.62,21.31 18.62,21.13
  Route15 0.254: v7.59,22.6 7.58,22.61 3.18,18.21 v3.15,18.21 | v10.13,18.77 10.36,18.55 | 10.36,18.55 13.05,18.55 13.38,18.88 13.38,19.49 | v2.51,10.9 2.5,10.91 2.5,13.6 v2.41,13.69 4.17,15.45 5.96,15.45 9.06,18.55 10.36,18.55 | v21.22,11.59 22.02,12.38 22.02,14.43 21.02,15.43 v21.02,15.59 21.02,18.86 21.01,18.87 | v13.36,20.43 13.38,20.43 13.38,19.49 | v18.6,21.33 18.6,21.28 21.01,18.87 | v10.29,22.59 13.38,19.49 | v25.41,17.9 24.44,18.87 21.01,18.87
  Bottom 0.254: v8.65,31.48 8.62,31.5 8.62,35.41 VDD.TP
VREGO  (via drill 0.3)
  Top 0.254: Q4.1 4.93,11.34 5.19,11.08 5.44,11.08 v6.13,10.39 v6.14,10.39 | v8.07,13.5 8.53,13.95 8.53,14.07 8.93,14.48 C19.1 9.33,14.74 10.28,15.69 12.29,15.69 12.99,14.98 U1.22
  Route15 0.254: v8.07,13.5 6.65,12.08 6.65,10.9 v6.14,10.39
WP  (via drill 0.3)
  Top 0.254: R5.2 25.09,10.03 v25.58,10.51 | IC1.3 24.48,0.88 v24.48,1.86
  Route15 0.254: v24.48,1.86 24.51,1.89 24.51,9.44 v25.58,10.51

### Text on the board
tPlace: SnapperGPS
bPlace: SnapperGPS | V2.1.0